# EAGLE design guageboard (EAGLE 6.4)
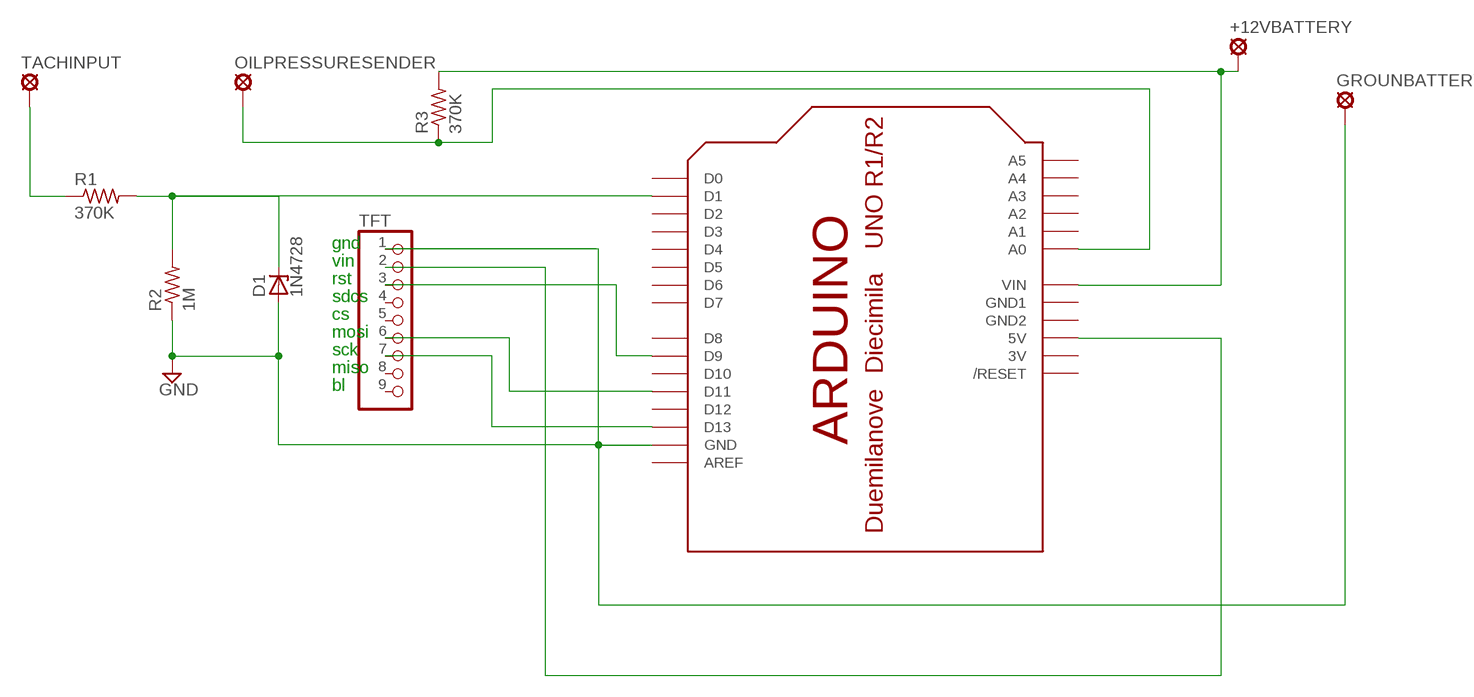
[diagram p0: schematic, sheet 1]

## Parts
+12VBATTERY  MCS10B  [MCS10B]
D1  1N4728  [DO41Z10]
GROUNBATTERY  MCS10B  [MCS10B]
OILPRESSURESENDER  MCS10B  [MCS10B]
R1  370K  R-US_0204/5  [0204/5]
R2  1M  R-US_0204/5  [0204/5]
R3  370K  R-US_0204/5  [0204/5]
TACHINPUT  MCS10B  [MCS10B]
TFT  PINHD-1X9  [1X09-BIG]
U$1  ARDUINOUNO  [ARDUINO]

## Nets
5V: TFT.2 U$1.5V
GND: D1.A GROUNBATTERY.MP R2.1 TFT.1 U$1.GND
N$1: D1.C R1.2 R2.2 U$1.D1
N$2: R1.1 TACHINPUT.MP
N$4: OILPRESSURESENDER.MP R3.1 U$1.A0
N$5: TFT.7 U$1.D13
N$6: TFT.6 U$1.D11
N$7: TFT.3 U$1.D9
VIN: +12VBATTERY.MP R3.2 U$1.VIN
Unconnected: TFT.4 TFT.5 TFT.8 TFT.9 U$1.A1 U$1.A2 U$1.A3 U$1.A4 U$1.A5 U$1.AREF U$1.D0 U$1.D2 U$1.D3 U$1.D4 U$1.D5 U$1.D6 U$1.D7 U$1.D8 U$1.D10 U$1.D12 U$1.RESET(/RESET)

## Notes on the sheet
- gnd
- vin
- rst
- sdcs
- cs
- mosi
- sck
- miso
- bl

## Power pins joined to a net without a drawn wire
3V: U$1.3V
GND: U$1.GND2
GND1: U$1.GND1

## Library data of the parts
+12VBATTERY GROUNBATTERY OILPRESSURESENDER TACHINPUT = solpad:MCS10B: SOLDER PAD MC S1, distributor Buerklin, 15F505
D1 = diode:1N4728: Z DIODE 3.3 V, 1W, 5 percent
R1-R3 = adafruit:R-US_: RESISTOR, American symbol
TFT = adafruit:PINHD-1X9: Pin header 1x10 0.1" spacing With round pins
U$1 = adafruit:ARDUINO: Arduino Diecimila/Duemilanove Make a shield with ease, this package has all the named pins as well as the two mounting drill holes and an outline of the USB and DC power connector. The outline is on the DIMENSION layer, so if your board house uses it they will cut the outline to match. http://www.ladyada.net/library/pcb/eaglelibrary.html

## Board
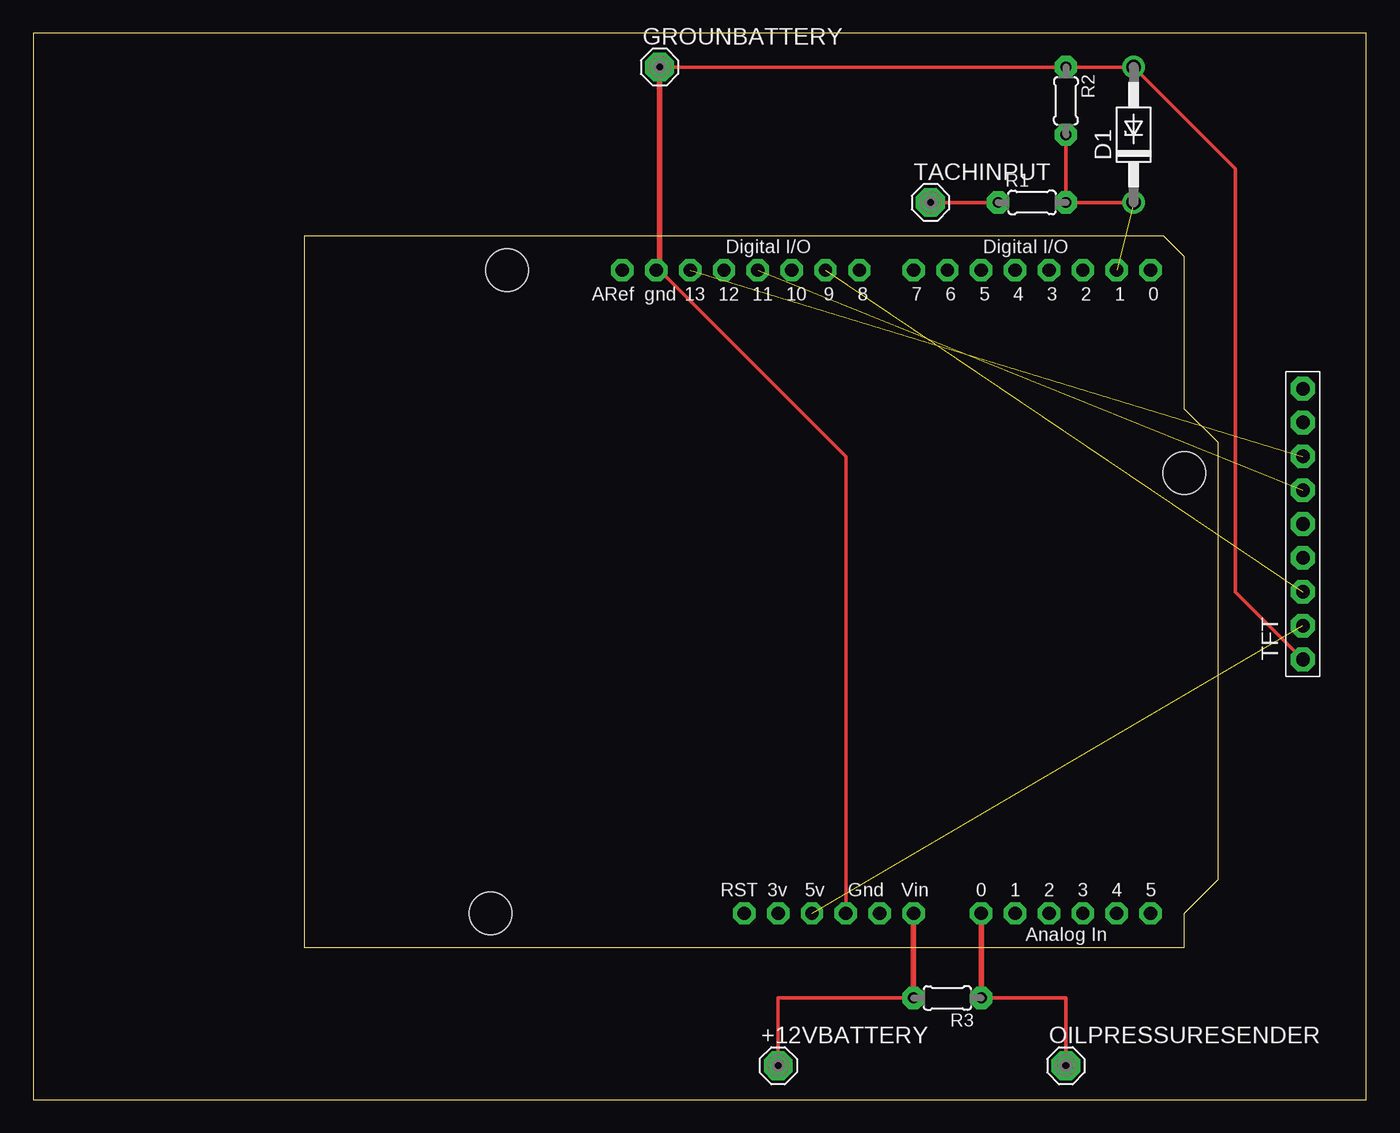
[diagram p1: board, top side]

Size 100 x 80 mm. Coordinates in mm from the lower left corner, seen from the top.
Outline: 0,0 100,0 100,80 0,80 0,0
Copper layers (1*16): Top 0.035mm / dielectric 1.5mm / Bottom 0.035mm
Design rules "default": minimum track width 10mil, minimum drill 24mil, track to track 8mil, track to pad 8mil, pad to pad 8mil, via to via 8mil, smd to smd 8mil, copper to edge 40mil, drill to drill 8mil, minimum pad ring 10mil, minimum via ring 8mil, stop-mask expansion 4mil, vias tented up to drill 0mil, thermal gap 10mil

### Footprints (pad centres in the part's own frame; a part is rotated, then mirrored left to right if it is on the bottom)
MCS10B = drill 1.016 pad 2.159 octagon: MP 0,0
DO41Z10 = drill 1.118: A 5.08,0; C -5.08,0
0204/5 = drill 0.813 pad 1.676 octagon: 1 -2.54,0; 2 2.54,0
1X09-BIG = drill 1.016 pad 1.778 octagon: 1 -10.16,0; 2 -7.62,0; 3 -5.08,0; 4 -2.54,0; 5 0,0; 6 2.54,0; 7 5.08,0; 8 7.62,0; 9 10.16,0
ARDUINO = drill 1 pad 1.676 octagon: 3V 35.56,2.54; 5V 38.1,2.54; A0 50.8,2.54; A1 53.34,2.54; A2 55.88,2.54; A3 58.42,2.54; A4 60.96,2.54; A5 63.5,2.54; AREF 23.876,50.8; D0 63.5,50.8; D1 60.96,50.8; D2 58.42,50.8; D3 55.88,50.8; D4 53.34,50.8; D5 50.8,50.8; D6 48.26,50.8; D7 45.72,50.8; D8 41.656,50.8; D9 39.116,50.8; D10 36.576,50.8; D11 34.036,50.8; D12 31.496,50.8; D13 28.956,50.8; GND 26.416,50.8; GND1 43.18,2.54; GND2 40.64,2.54; RESET 33.02,2.54; VIN 45.72,2.54 | hole 3.2: 15.24,50.8; 66.04,35.56; 13.97,2.54

### Placement (x,y rotation side)
+12VBATTERY  55.88,2.54 0 top
D1  82.55,72.39 90 top
GROUNBATTERY  46.99,77.47 0 top
OILPRESSURESENDER  77.47,2.54 0 top
R1  74.93,67.31 0 top
R2  77.47,74.93 270 top
R3  68.58,7.62 180 top
TACHINPUT  67.31,67.31 0 top
TFT  95.25,43.18 90 top
U$1  20.32,11.43 0 top

### Tracks (layer width: path | path; a pad name or v marks a point on that pad's centre or on a via)
5V  (1 unrouted)
GND
  Top 0.254: 46.99,62.23 60.96,48.26 U$1.GND2 | TFT.1 90.17,38.1 90.17,69.85 D1.A R2.1 GROUNBATTERY.MP
  Top 0.406: U$1.GND 46.99,62.23 GROUNBATTERY.MP
N$1  (1 unrouted)
  Top 0.254: R2.2 R1.2 D1.C
N$2
  Top 0.254: TACHINPUT.MP R1.1
N$4
  Top 0.254: R3.1 77.47,7.62 OILPRESSURESENDER.MP
  Top 0.406: U$1.A0 R3.1
N$5  (1 unrouted)
N$6  (1 unrouted)
N$7  (1 unrouted)
VIN
  Top 0.254: R3.2 55.88,7.62 +12VBATTERY.MP
  Top 0.406: U$1.VIN R3.2